# EAGLE design DAC adapter V2 (EAGLE 7.3.0)
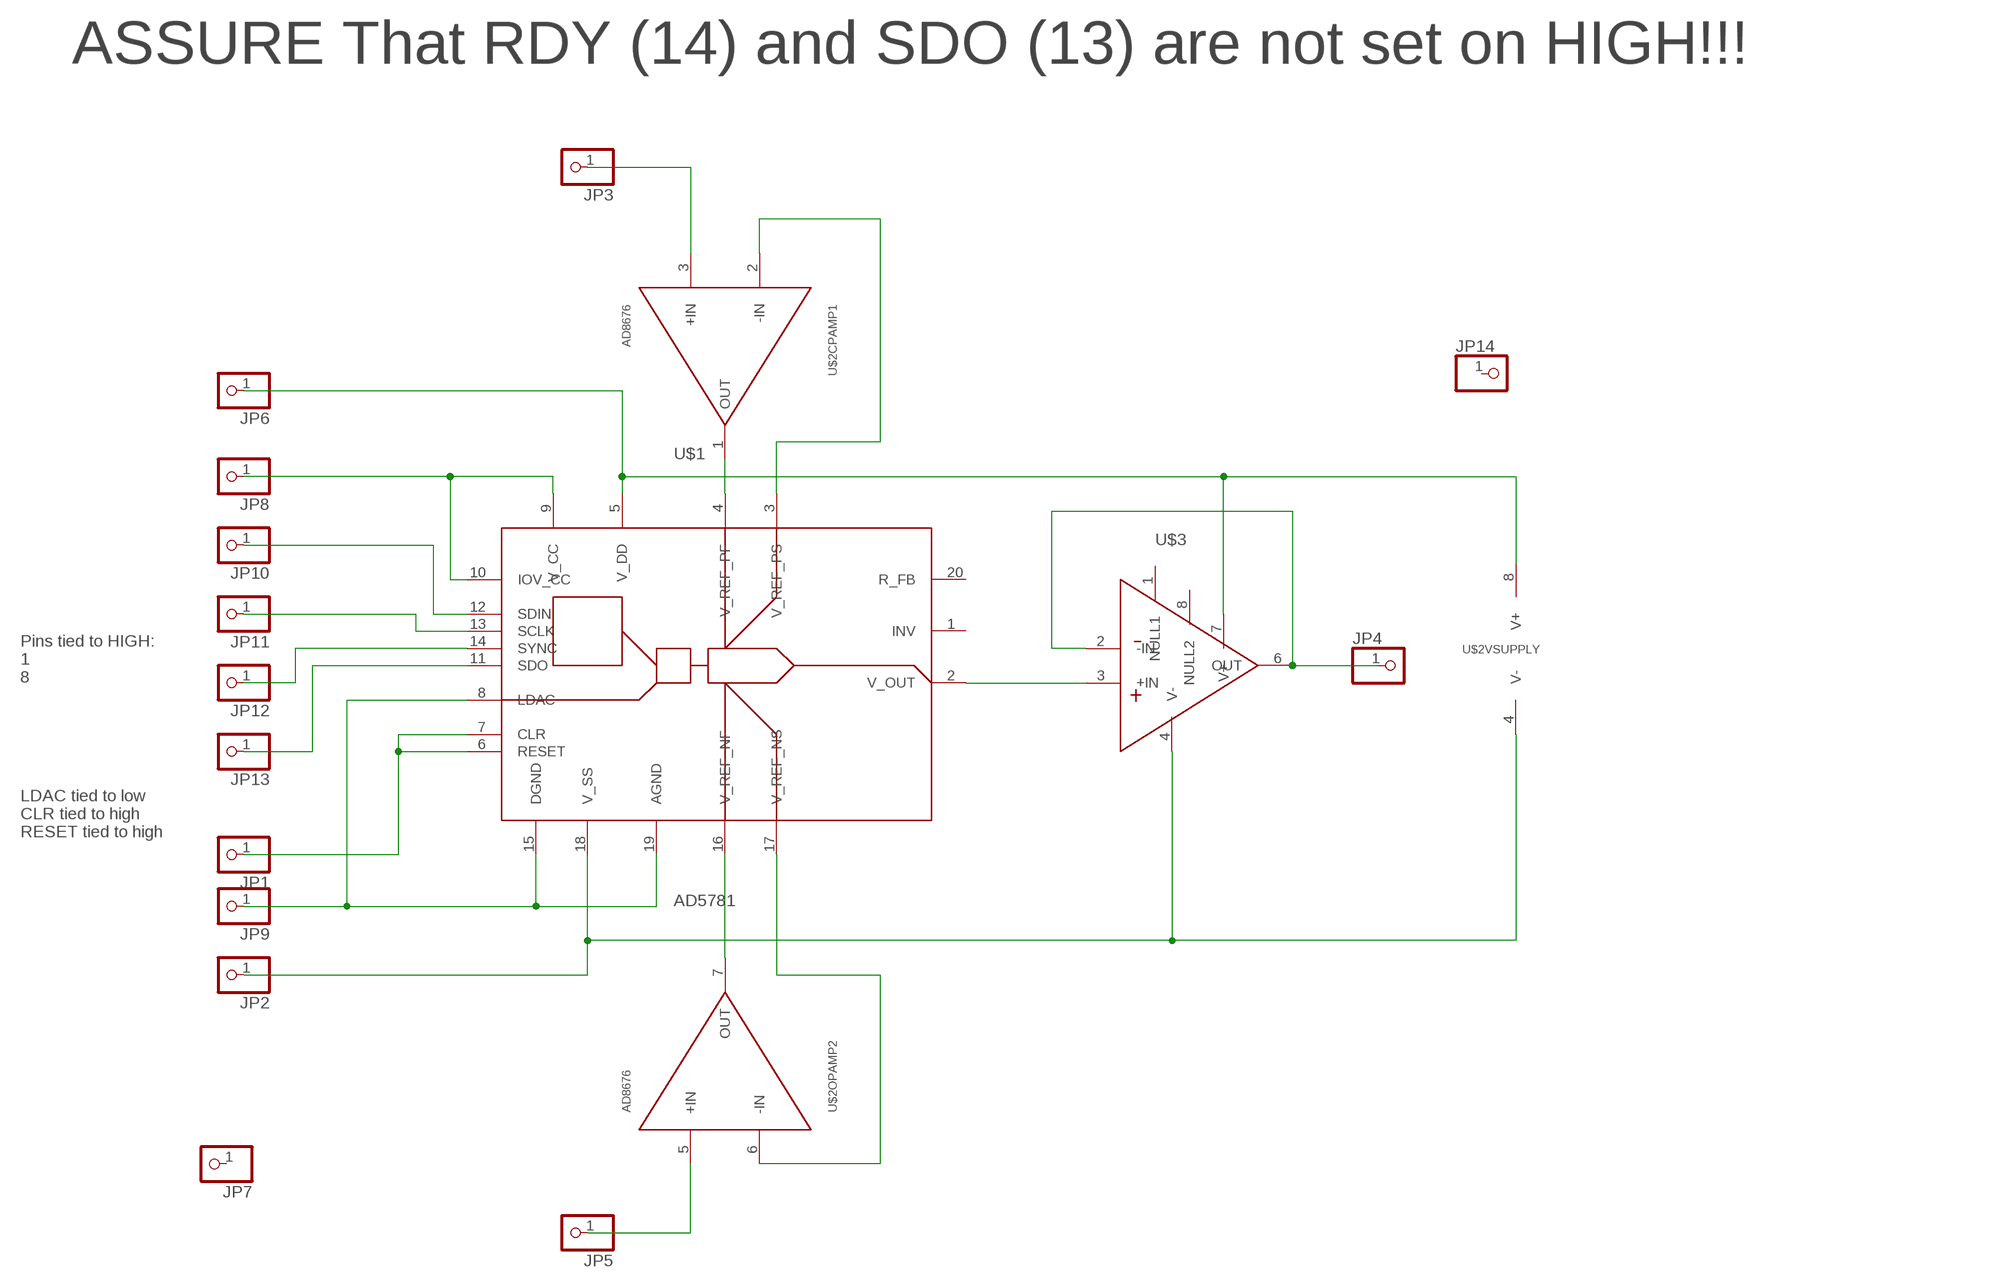
[diagram p0: schematic, sheet 1]

## Parts
JP1  PINHD-1X1  [1X01]
JP2  PINHD-1X1  [1X01]
JP3  PINHD-1X1  [1X01]
JP4  PINHD-1X1  [1X01]
JP5  PINHD-1X1  [1X01]
JP6  PINHD-1X1  [1X01]
JP7  PINHD-1X1  [1X01]
JP8  PINHD-1X1  [1X01]
JP9  PINHD-1X1  [1X01]
JP10  PINHD-1X1  [1X01]
JP11  PINHD-1X1  [1X01]
JP12  PINHD-1X1  [1X01]
JP13  PINHD-1X1  [1X01]
JP14  PINHD-1X1  [1X01]
U$1  AD5781  [TSSOP20]
U$2  AD8676  [MSOP08]
U$3  AD8675  [MSOP08]

## Nets
N$1: U$1.2(V_OUT) U$3.3(+IN)
N$2: JP4.1 U$3.2(-IN) U$3.6(OUT)
N$3: U$1.16(V_REF_NF) U$2.7(OPAMP2:OUT)
N$4: U$1.17(V_REF_NS) U$2.6(OPAMP2:-IN)
N$5: U$1.4(V_REF_PF) U$2.1(CPAMP1:OUT)
N$6: U$1.3(V_REF_PS) U$2.2(CPAMP1:-IN)
N$7: JP1.1 U$1.6(RESET) U$1.7(CLR)
N$9: JP2.1 U$1.18(V_SS) U$2.4(VSUPPLY:V-) U$3.4(V-)
N$10: JP5.1 U$2.5(OPAMP2:+IN)
N$11: JP3.1 U$2.3(CPAMP1:+IN)
N$12: JP6.1 U$1.5(V_DD) U$2.8(VSUPPLY:V+) U$3.7(V+)
N$13: JP8.1 U$1.9(V_CC) U$1.10(IOV_CC)
N$14: JP9.1 U$1.8(LDAC) U$1.15(DGND) U$1.19(AGND)
N$15: JP10.1 U$1.12(SDIN)
N$16: JP11.1 U$1.13(SCLK)
N$17: JP12.1 U$1.14(SYNC)
N$18: JP13.1 U$1.11(SDO)
Unconnected: JP7.1 JP14.1 U$1.1(INV) U$1.20(R_FB) U$3.1(NULL1) U$3.8(NULL2)

## Notes on the sheet
- ASSURE That RDY (14) and SDO (13) are not set on HIGH!!!
- Pins tied to HIGH:
  1
  8
- LDAC tied to low
  CLR tied to high
  RESET tied to high

## Library data of the parts
JP1-JP14 = pinhead:PINHD-1X1: PIN HEADER
U$1 = Marcell:AD5781
U$2 = Marcell:AD8676
U$3 = Marcell:AD8675

## Board
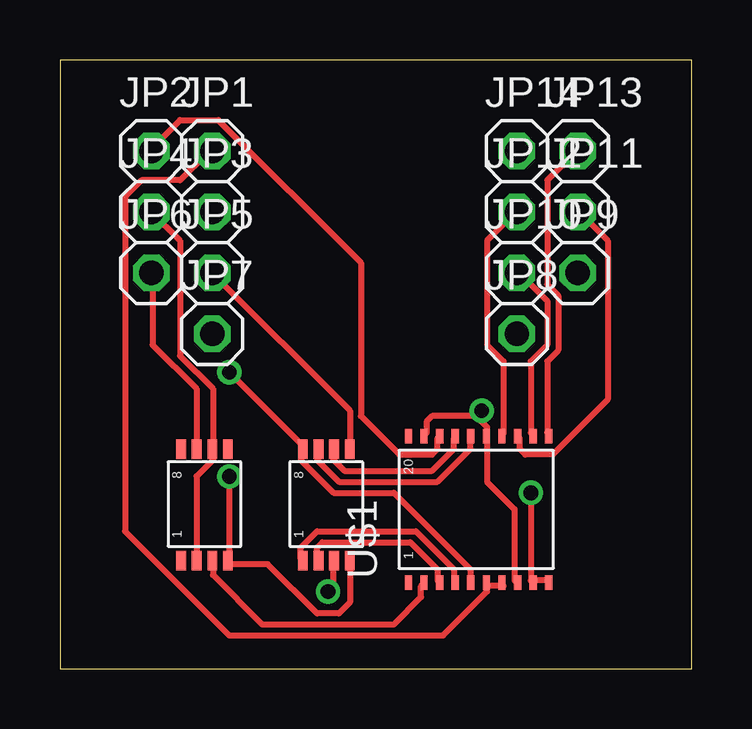
[diagram p1: board, top side]
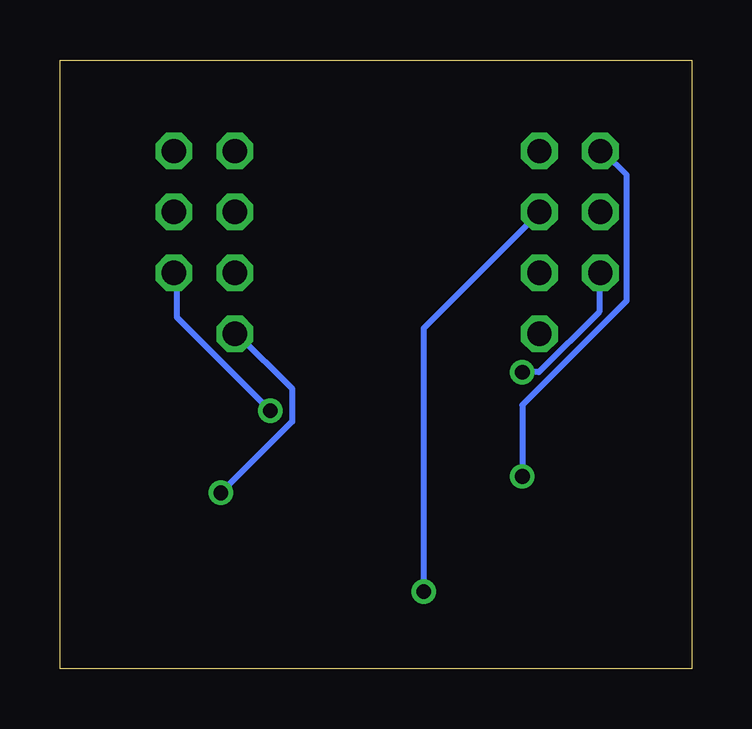
[diagram p2: board, bottom side, seen from below]

Size 26.34 x 25.39 mm. Coordinates in mm from the lower left corner, seen from the top.
Outline: 0,0 26.34,0 26.34,25.39 0,25.39 0,0
Copper layers (1*16): Top 0.035mm / dielectric 1.5mm / Bottom 0.035mm
Design rules "default": minimum track width 10mil, minimum drill 24mil, track to track 8mil, track to pad 8mil, pad to pad 8mil, via to via 8mil, smd to smd 8mil, copper to edge 40mil, drill to drill 8mil, minimum pad ring 10mil, minimum via ring 8mil, stop-mask expansion 4mil, vias tented up to drill 0mil, thermal gap 10mil

### Footprints (pad centres in the part's own frame; a part is rotated, then mirrored left to right if it is on the bottom)
1X01 = drill 1.016 octagon: 1 0,0
TSSOP20 = smd 0.61 x 0.305: 1 -2.752,3.25; 2 -2.752,2.6; 3 -2.752,1.95; 4 -2.752,1.3; 5 -2.752,0.65; 6 -2.752,0; 7 -2.752,-0.65; 8 -2.752,-1.3; 9 -2.752,-1.95; 10 -2.752,-2.6; 11 3.35,-2.6; 12 3.35,-1.95; 13 3.35,-1.3; 14 3.35,-0.65; 15 3.35,0; 16 3.35,0.65; 17 3.35,1.3; 18 3.35,1.95; 19 3.35,2.6; 20 3.35,3.25
MSOP08 = smd 0.813 x 0.406: 1 -3.104,1.3; 2 -3.104,0.65; 3 -3.104,0; 4 -3.104,-0.65; 5 1.55,-0.65; 6 1.55,0; 7 1.55,0.65; 8 1.55,1.3

### Placement (x,y rotation side)
JP1  6.35,21.59 0 top
JP2  3.81,21.59 0 top
JP3  6.35,19.05 0 top
JP4  3.81,19.05 0 top
JP5  6.35,16.51 0 top
JP6  3.81,16.51 0 top
JP7  6.35,13.97 0 top
JP8  19.05,13.97 0 top
JP9  21.59,16.51 0 top
JP10  19.05,16.51 0 top
JP11  21.59,19.05 0 top
JP12  19.05,19.05 0 top
JP13  21.59,21.59 0 top
JP14  19.05,21.59 0 top
U$1  17.78,6.35 90 top
U$2  11.43,7.62 90 top
U$3  6.35,7.62 90 top

### Tracks (layer width: path | path; a pad name or v marks a point on that pad's centre or on a via)
N$1
  Top 0.254: U$1.2 15.06,3.45 15.06,3 13.92,1.85 8.43,1.85 6.37,3.91 6.37,4.37 U$3.3
N$2
  Top 0.254: U$3.2 5.69,4.6 5.69,8.03 6.37,8.71 6.37,9.17 U$3.6 6.37,9.4 6.37,11.68 5,13.06 5,17.86 JP4.1
N$3
  Top 0.254: U$1.16 17.12,9.63 17.12,9.17 15.75,7.8 11.63,7.8 10.72,8.71 10.72,9.17 U$2.7
N$4
  Top 0.254: U$1.17 16.43,9.63 16.43,9.17 15.52,8.25 11.86,8.25 11.41,8.71 11.41,9.17 U$2.6
N$5
  Top 0.254: U$1.4 16.43,3.68 16.43,4.14 14.83,5.74 10.72,5.74 10.03,5.05 10.03,4.6 U$2.1
N$6
  Top 0.254: U$1.3 15.75,3.68 15.75,4.14 14.61,5.28 10.95,5.28 10.72,5.05 10.72,4.6 U$2.2
N$7
  Top 0.254: 17.8,3.45 18.49,3.45 U$1.7 | 17.8,3.45 17.8,3.23 15.98,1.4 7.06,1.4 2.72,5.74 2.72,19.68 3.4,20.37 5,20.37 6.15,21.51 JP1.1 | 17.8,3.45 U$1.6
N$9  (via drill 0.61)
  Top 0.254: U$2.4 12.09,4.37 12.09,2.77 11.63,2.31 10.72,2.31 8.66,4.37 7.06,4.37 U$3.4 7.06,4.6 v7.06,8.03 | U$1.18 15.75,9.63 15.75,9.17 15.52,8.94 14.15,8.94 12.55,10.54 12.55,16.94 6.6,22.88 5,22.88 3.86,21.74 JP2.1
  Bottom 0.254: v7.06,8.03 7.06,11 2.72,15.34 2.72,20.6 3.63,21.51 JP2.1
N$10
  Top 0.254: JP5.1 12.09,10.77 12.09,9.4 U$2.5
N$11  (via drill 0.61)
  Top 0.254: v11.18,3.23 11.41,3.45 11.41,4.37 U$2.3
  Bottom 0.254: v11.18,3.23 11.18,14.2 6.37,19 JP3.1
N$12  (via drill 0.61)
  Top 0.254: U$1.5 17.12,3.68 17.12,4.14 13.92,7.34 11.41,7.34 10.03,8.71 10.03,9.17 U$2.8 10.03,9.4 v7.06,12.37 | U$3.7 5.69,9.4 5.69,11.68 3.86,13.51 3.86,16.48 JP6.1
  Bottom 0.254: v7.06,12.37 6.37,12.37 3.86,14.88 3.86,16.48 JP6.1
N$13  (via drill 0.61)
  Top 0.254: U$1.10 20.32,3.68 19.86,3.68 U$1.9 19.63,3.68 v19.63,7.34
  Bottom 0.254: v19.63,7.34 16.66,10.31 16.66,11.68 18.95,13.97 JP8.1
N$14  (via drill 0.61)
  Top 0.254: 17.35,10.54 15.52,10.54 15.29,10.31 15.29,9.86 U$1.19 | 17.35,10.54 17.8,10.08 17.8,9.86 U$1.15 17.8,9.63 17.8,7.8 18.95,6.65 18.95,3.68 U$1.8 | 17.35,10.54 v17.58,10.77
  Bottom 0.254: v17.58,10.77 21.46,14.66 21.46,16.48 JP9.1
N$15
  Top 0.254: U$1.12 19.63,9.86 19.63,12.83 20.32,13.51 20.32,15.34 19.18,16.48 JP10.1
N$16
  Top 0.254: U$1.13 19.18,9.63 19.18,9.17 19.41,8.94 20.55,8.94 22.84,11.23 22.84,17.86 21.69,19 JP11.1
N$17
  Top 0.254: U$1.14 18.49,9.86 18.49,12.83 17.8,13.51 17.8,17.86 18.95,19 JP12.1
N$18
  Top 0.254: U$1.11 20.32,9.86 20.32,12.83 20.78,13.28 20.78,15.57 20.32,16.03 20.32,20.37 21.46,21.51 JP13.1

### Text on the board
tDocu: AD8675 | AD8676